# EAGLE schematic CatCarousel (EAGLE 9.6.2)
PowrCntr Power Control System
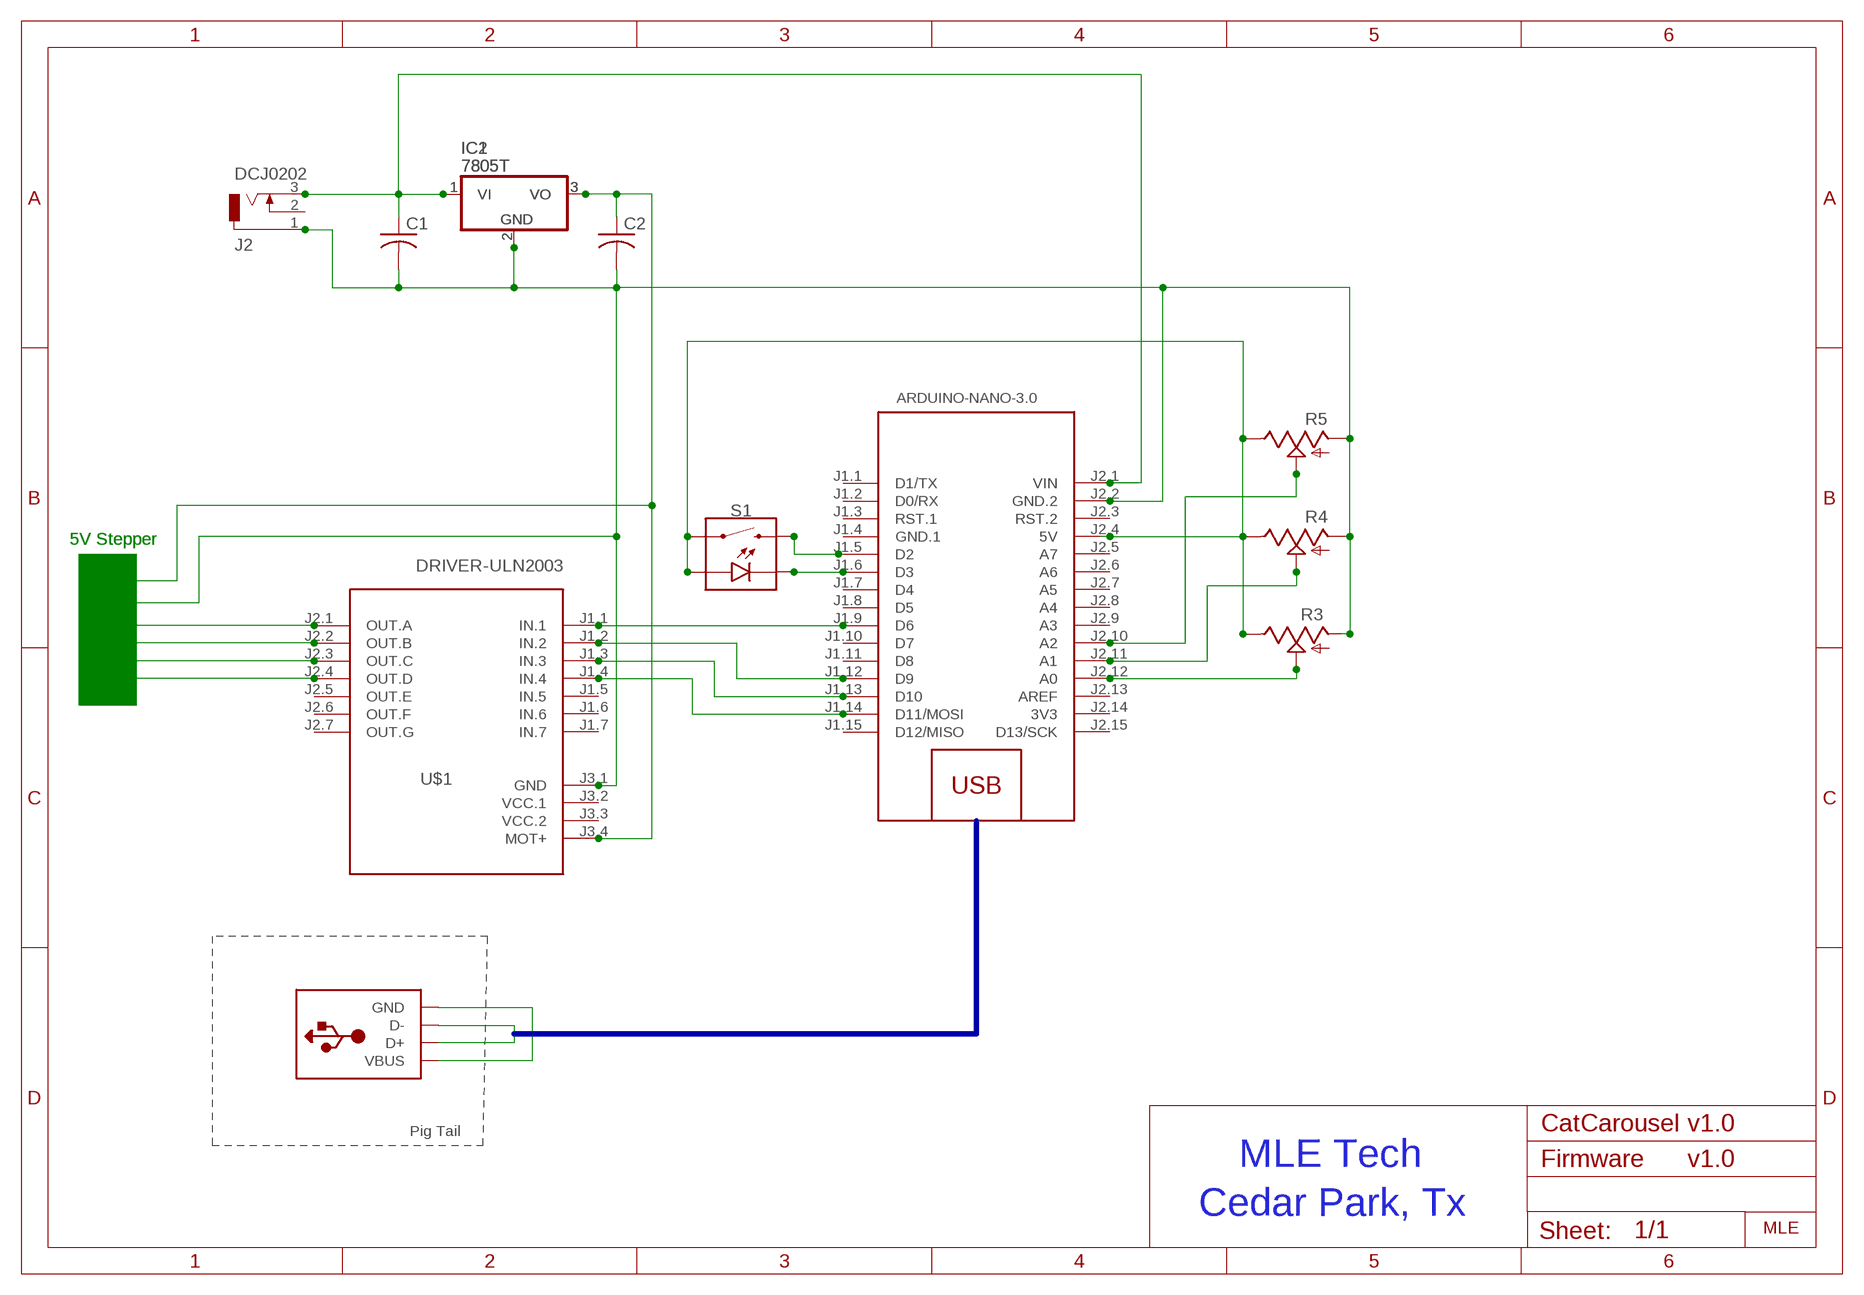
[diagram p0: schematic, sheet 1]

## Parts
C1  C-US025-024X044  [C025-024X044]
C2  C-US025-024X044  [C025-024X044]
IC1  7805T  [TO220H]
IC2  7805T  [TO220H]
J2  DCJ0202  [DCJ0202]
M1  ARDUINO-NANO-3.0  [ARDUINO-NANO-3.0]
R3  TRIM_US-CA14H  [CA14H]
R4  TRIM_US-CA14H  [CA14H]
R5  TRIM_US-CA14H  [CA14H]
S1  MOMENTARY-SWITCH-SPST-LED-PTH-12MM  [TACTILE_SWITCH_LED_PTH_12MM]
U$1  DRIVER-ULN2003  [DRIVER-ULN2003]
X2  USB-A  [MOLEX_480371000]

## Nets
N$1: C1.1 IC1.1(VI) IC2.1(VI) J2.3 M1.J2.1(VIN)
N$2: U$1.J2.2(OUT.B)
N$3: M1.J1.6(D3) S1.C
N$4: M1.J1.9(D6) U$1.J1.1(IN.1)
N$5: M1.J2.12(A0) R3.S
N$6: M1.J2.11(A1) R4.S
N$7: M1.J1.14(D11/MOSI) U$1.J1.4(IN.4)
N$8: M1.J2.10(A2) R5.S
N$10: M1.J1.13(D10) U$1.J1.3(IN.3)
N$11: M1.J1.12(D9) U$1.J1.2(IN.2)
N$12: M1.J1.5(D2) S1.2
N$13: C2.1 IC1.3(VO) IC2.3(VO) U$1.J3.4(MOT+)
N$14: M1.J2.4(5V) R3.E R4.E R5.E S1.4 S1.A
N$15: U$1.J2.1(OUT.A)
N$16: U$1.J2.3(OUT.C)
N$17: U$1.J2.4(OUT.D)
N$18: C1.2 C2.2 IC1.2(GND) IC2.2(GND) J2.1 M1.J2.2(GND.2) R3.A R4.A R5.A U$1.J3.1(GND)
N$29: X2.2(D-) X2.3(D+)
N$30: X2.1(VBUS) X2.4(GND)
Unconnected: J2.2 M1.J1.1(D1/TX) M1.J1.2(D0/RX) M1.J1.3(RST.1) M1.J1.7(D4) M1.J1.8(D5) M1.J1.10(D7) M1.J1.11(D8) M1.J1.15(D12/MISO) M1.J2.3(RST.2) M1.J2.5(A7) M1.J2.6(A6) M1.J2.7(A5) M1.J2.8(A4) M1.J2.9(A3) M1.J2.13(AREF) M1.J2.15(D13/SCK) U$1.J1.5(IN.5) U$1.J1.6(IN.6) U$1.J1.7(IN.7) U$1.J2.5(OUT.E) U$1.J2.6(OUT.F) U$1.J2.7(OUT.G) U$1.J3.3(VCC.2)

## Buses
N$14,N$12,N$11,N$26,N$27,N$28

## Notes on the sheet
- 5V Stepper | 5V Stepper
- v1.0
- Pig Tail
- MLE Tech | Firmware | v1.0
- Cedar Park, Tx
- MLE

## Power pins joined to a net without a drawn wire
3V3: M1.J2.14(3V3)
GND.1: M1.J1.4(GND.1)
VCC.1: U$1.J3.2(VCC.1)

## Library data of the parts
C1 C2 = rcl:C-US: CAPACITOR, American symbol; SPICEPREFIX: C
IC1 IC2 = linear:78*: Positive VOLTAGE REGULATOR Source: http://cache.national.com/ds/LM/LM78L05.pdf http://www.fairchildsemi.com/ds/LM/LM7805.pdf
J2 = con-jack:DCJ0202: DC POWER JACK Source: DCJ0202.pdf; OC_FARNELL: unknown; OC_NEWARK: unknown
M1 = diy-modules:ARDUINO-NANO-3.0: Arduino Nano 3.0 and compatible devices More details available here: https://www.arduino.cc/en/Main/ArduinoBoardNano Click here to find device on ebay.com <http://www.ebay.com/sch/arduino+nano>
R3-R5 = pot:TRIM_US-: POTENTIOMETER
S1 = SparkFun-Switches:MOMENTARY-SWITCH-SPST-LED: Momentary Switch (Pushbutton) - SPST - w/ LED Normally-open (NO) SPST momentary switches (buttons, pushbuttons), with a built-in LED. Variants PTH-CHERRY - Cherry MX Switch Cherry MX Keyswitches are top-of-the-line mechanical keyboard switches. They’re satisfyingly “clicky”, reliable up to tens-of-millions of key presses, and a standard in gaming and programming keyboards across the globe. This ‘blue’ version Cherry MX Switch is favored by most due to its secondary internal actuator making it less likely to “double-tap.” If you are looking for a noticeably audible and high-quality key switch, this is the perfect option for you! Cherry MX Switch <https://www.sparkfun.com/products/13834> (COM-13834) Cherry MX Switch Breakout <https://www.sparkfun.com/products/13773> (BOB-13773) PTH-12MM and PTH-12MM-KIT - 12mm Illuminated LED KIT variant is for soldering kits. There is no tStop (covering up the top side of the pads with mask). This helps the beginner see which side they should be soldering too. LED Tactile Button Breakout <https://www.sparkfun.com/products/10467> (BOB-10467) LED Tactile Button - Red <https://www.sparkfun.com/products/10442> (COM-10442) LED Tactile Button - Blue <https://www.sparkfun.com/products/10443> (COM-10443) LED Tactile Button - Green <https://www.sparkfun.com/products/10440> (COM-10440) LED Tactile Button - Orange <https://www.sparkfun.com/products/10441> (COM-10441) LED Tactile Button - White <https://www.sparkfun.com/products/10439> (COM-10439); PROD_ID: SWCH-11758; SF_SKU: COM-10442
U$1 = diy-modules0:DRIVER-ULN2003: 7-Channel Darlington NPN Transistor Module based on ULN2003 chip
X2 = adafruit:USB-A: USB type A 'plug' Used for things that can directly connect to a USB port, say USB key